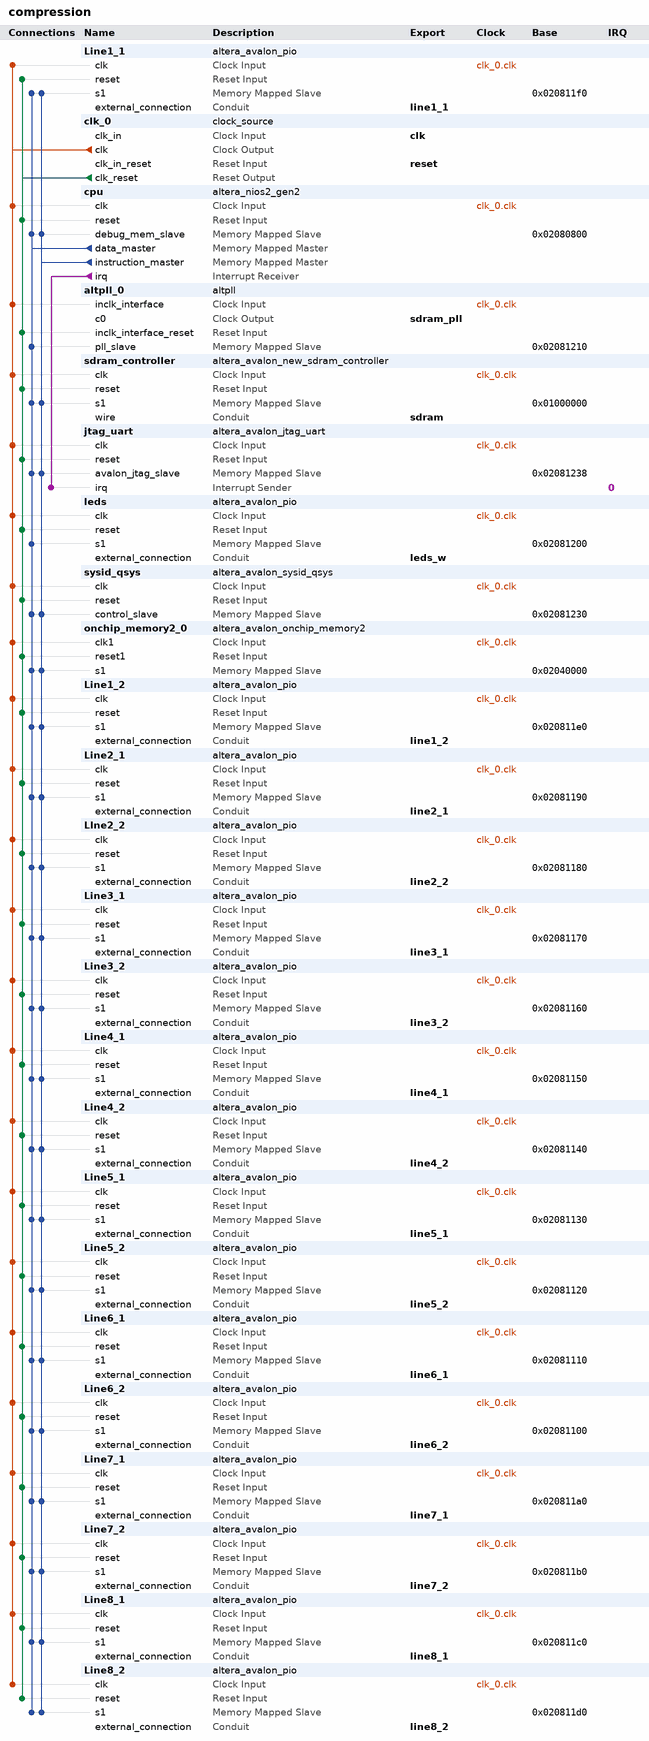
[diagram p0: system contents]
# Platform Designer (Qsys) system compression, Cyclone IV GX EP4CGX110CF23C7
# Parameters at their usual value, and those the tool derives, are not listed.
package require -exact qsys 18.1
create_system compression
set_project_property DEVICE_FAMILY {Cyclone IV GX}
set_project_property DEVICE EP4CGX110CF23C7

add_instance Line1_1 altera_avalon_pio 18.1
set_instance_parameter_value Line1_1 direction InOut
set_instance_parameter_value Line1_1 width 32

add_instance clk_0 clock_source 18.1
set_instance_parameter_value clk_0 clockFrequency 50000000

add_instance cpu altera_nios2_gen2 18.1
set_instance_parameter_value cpu dcache_size 2048
set_instance_parameter_value cpu exceptionSlave sdram_controller.s1
set_instance_parameter_value cpu icache_size 65536
set_instance_parameter_value cpu impl Tiny
set_instance_parameter_value cpu resetSlave sdram_controller.s1

add_instance altpll_0 altpll 18.1
set_instance_parameter_value altpll_0 CLK0_DIVIDE_BY 1
set_instance_parameter_value altpll_0 CLK0_MULTIPLY_BY 1
set_instance_parameter_value altpll_0 CLK0_PHASE_SHIFT -3000
set_instance_parameter_value altpll_0 INCLK0_INPUT_FREQUENCY 20000
set_instance_parameter_value altpll_0 PORT_ARESET PORT_UNUSED
set_instance_parameter_value altpll_0 PORT_LOCKED PORT_UNUSED
set_instance_parameter_value altpll_0 PORT_clk1 PORT_UNUSED
set_instance_parameter_value altpll_0 PORT_clk2 PORT_UNUSED
set_instance_parameter_value altpll_0 PORT_clk3 PORT_UNUSED

add_instance sdram_controller altera_avalon_new_sdram_controller 18.1
set_instance_parameter_value sdram_controller TAC 5.5
set_instance_parameter_value sdram_controller TRCD 20.0
set_instance_parameter_value sdram_controller TRP 20.0
set_instance_parameter_value sdram_controller casLatency 3
set_instance_parameter_value sdram_controller columnWidth 8
set_instance_parameter_value sdram_controller dataWidth 32
set_instance_parameter_value sdram_controller generateSimulationModel false
set_instance_parameter_value sdram_controller model single_Micron_MT48LC4M32B2_7_chip
set_instance_parameter_value sdram_controller numberOfBanks 4
set_instance_parameter_value sdram_controller numberOfChipSelects 1
set_instance_parameter_value sdram_controller powerUpDelay 100.0
set_instance_parameter_value sdram_controller refreshPeriod 15.625
set_instance_parameter_value sdram_controller rowWidth 12

add_instance jtag_uart altera_avalon_jtag_uart 18.1
set_instance_parameter_value jtag_uart simInteractiveOptions NO_INTERACTIVE_WINDOWS

add_instance leds altera_avalon_pio 18.1
set_instance_parameter_value leds direction Output
set_instance_parameter_value leds width 8

add_instance sysid_qsys altera_avalon_sysid_qsys 18.1
set_instance_parameter_value sysid_qsys id 0

add_instance onchip_memory2_0 altera_avalon_onchip_memory2 18.1
set_instance_parameter_value onchip_memory2_0 dataWidth 32
set_instance_parameter_value onchip_memory2_0 dualPort false
set_instance_parameter_value onchip_memory2_0 initMemContent true
set_instance_parameter_value onchip_memory2_0 initializationFileName onchip_mem.hex
set_instance_parameter_value onchip_memory2_0 memorySize 204800

add_instance Line1_2 altera_avalon_pio 18.1
set_instance_parameter_value Line1_2 direction InOut
set_instance_parameter_value Line1_2 width 32

add_instance Line2_1 altera_avalon_pio 18.1
set_instance_parameter_value Line2_1 direction InOut
set_instance_parameter_value Line2_1 width 32

add_instance LIne2_2 altera_avalon_pio 18.1
set_instance_parameter_value LIne2_2 direction InOut
set_instance_parameter_value LIne2_2 width 32

add_instance Line3_1 altera_avalon_pio 18.1
set_instance_parameter_value Line3_1 direction InOut
set_instance_parameter_value Line3_1 width 32

add_instance Line3_2 altera_avalon_pio 18.1
set_instance_parameter_value Line3_2 direction InOut
set_instance_parameter_value Line3_2 width 32

add_instance Line4_1 altera_avalon_pio 18.1
set_instance_parameter_value Line4_1 direction InOut
set_instance_parameter_value Line4_1 width 32

add_instance Line4_2 altera_avalon_pio 18.1
set_instance_parameter_value Line4_2 direction InOut
set_instance_parameter_value Line4_2 width 32

add_instance Line5_1 altera_avalon_pio 18.1
set_instance_parameter_value Line5_1 direction InOut
set_instance_parameter_value Line5_1 width 32

add_instance Line5_2 altera_avalon_pio 18.1
set_instance_parameter_value Line5_2 direction InOut
set_instance_parameter_value Line5_2 width 32

add_instance Line6_1 altera_avalon_pio 18.1
set_instance_parameter_value Line6_1 direction InOut
set_instance_parameter_value Line6_1 width 32

add_instance Line6_2 altera_avalon_pio 18.1
set_instance_parameter_value Line6_2 direction InOut
set_instance_parameter_value Line6_2 width 32

add_instance Line7_1 altera_avalon_pio 18.1
set_instance_parameter_value Line7_1 direction InOut
set_instance_parameter_value Line7_1 width 32

add_instance Line7_2 altera_avalon_pio 18.1
set_instance_parameter_value Line7_2 direction InOut
set_instance_parameter_value Line7_2 width 32

add_instance Line8_1 altera_avalon_pio 18.1
set_instance_parameter_value Line8_1 direction InOut
set_instance_parameter_value Line8_1 width 32

add_instance Line8_2 altera_avalon_pio 18.1
set_instance_parameter_value Line8_2 direction InOut
set_instance_parameter_value Line8_2 width 32

# connections
add_connection clk_0.clk altpll_0.inclk_interface clock
add_connection clk_0.clk cpu.clk clock
add_connection clk_0.clk jtag_uart.clk clock
add_connection clk_0.clk leds.clk clock
add_connection clk_0.clk Line1_1.clk clock
add_connection clk_0.clk Line1_2.clk clock
add_connection clk_0.clk Line2_1.clk clock
add_connection clk_0.clk LIne2_2.clk clock
add_connection clk_0.clk Line3_1.clk clock
add_connection clk_0.clk Line3_2.clk clock
add_connection clk_0.clk Line4_1.clk clock
add_connection clk_0.clk Line4_2.clk clock
add_connection clk_0.clk Line5_1.clk clock
add_connection clk_0.clk Line5_2.clk clock
add_connection clk_0.clk Line6_1.clk clock
add_connection clk_0.clk Line6_2.clk clock
add_connection clk_0.clk Line7_1.clk clock
add_connection clk_0.clk Line7_2.clk clock
add_connection clk_0.clk Line8_1.clk clock
add_connection clk_0.clk Line8_2.clk clock
add_connection clk_0.clk onchip_memory2_0.clk1 clock
add_connection clk_0.clk sdram_controller.clk clock
add_connection clk_0.clk sysid_qsys.clk clock
add_connection clk_0.clk_reset altpll_0.inclk_interface_reset reset
add_connection clk_0.clk_reset cpu.reset reset
add_connection clk_0.clk_reset jtag_uart.reset reset
add_connection clk_0.clk_reset leds.reset reset
add_connection clk_0.clk_reset Line1_1.reset reset
add_connection clk_0.clk_reset Line1_2.reset reset
add_connection clk_0.clk_reset Line2_1.reset reset
add_connection clk_0.clk_reset LIne2_2.reset reset
add_connection clk_0.clk_reset Line3_1.reset reset
add_connection clk_0.clk_reset Line3_2.reset reset
add_connection clk_0.clk_reset Line4_1.reset reset
add_connection clk_0.clk_reset Line4_2.reset reset
add_connection clk_0.clk_reset Line5_1.reset reset
add_connection clk_0.clk_reset Line5_2.reset reset
add_connection clk_0.clk_reset Line6_1.reset reset
add_connection clk_0.clk_reset Line6_2.reset reset
add_connection clk_0.clk_reset Line7_1.reset reset
add_connection clk_0.clk_reset Line7_2.reset reset
add_connection clk_0.clk_reset Line8_1.reset reset
add_connection clk_0.clk_reset Line8_2.reset reset
add_connection clk_0.clk_reset onchip_memory2_0.reset1 reset
add_connection clk_0.clk_reset sdram_controller.reset reset
add_connection clk_0.clk_reset sysid_qsys.reset reset
add_connection cpu.data_master altpll_0.pll_slave avalon
set_connection_parameter_value cpu.data_master/altpll_0.pll_slave baseAddress 0x02081210
add_connection cpu.data_master cpu.debug_mem_slave avalon
set_connection_parameter_value cpu.data_master/cpu.debug_mem_slave baseAddress 0x02080800
add_connection cpu.data_master jtag_uart.avalon_jtag_slave avalon
set_connection_parameter_value cpu.data_master/jtag_uart.avalon_jtag_slave baseAddress 0x02081238
add_connection cpu.data_master leds.s1 avalon
set_connection_parameter_value cpu.data_master/leds.s1 baseAddress 0x02081200
add_connection cpu.data_master Line1_1.s1 avalon
set_connection_parameter_value cpu.data_master/Line1_1.s1 baseAddress 0x020811f0
add_connection cpu.data_master Line1_2.s1 avalon
set_connection_parameter_value cpu.data_master/Line1_2.s1 baseAddress 0x020811e0
add_connection cpu.data_master Line2_1.s1 avalon
set_connection_parameter_value cpu.data_master/Line2_1.s1 baseAddress 0x02081190
add_connection cpu.data_master LIne2_2.s1 avalon
set_connection_parameter_value cpu.data_master/LIne2_2.s1 baseAddress 0x02081180
add_connection cpu.data_master Line3_1.s1 avalon
set_connection_parameter_value cpu.data_master/Line3_1.s1 baseAddress 0x02081170
add_connection cpu.data_master Line3_2.s1 avalon
set_connection_parameter_value cpu.data_master/Line3_2.s1 baseAddress 0x02081160
add_connection cpu.data_master Line4_1.s1 avalon
set_connection_parameter_value cpu.data_master/Line4_1.s1 baseAddress 0x02081150
add_connection cpu.data_master Line4_2.s1 avalon
set_connection_parameter_value cpu.data_master/Line4_2.s1 baseAddress 0x02081140
add_connection cpu.data_master Line5_1.s1 avalon
set_connection_parameter_value cpu.data_master/Line5_1.s1 baseAddress 0x02081130
add_connection cpu.data_master Line5_2.s1 avalon
set_connection_parameter_value cpu.data_master/Line5_2.s1 baseAddress 0x02081120
add_connection cpu.data_master Line6_1.s1 avalon
set_connection_parameter_value cpu.data_master/Line6_1.s1 baseAddress 0x02081110
add_connection cpu.data_master Line6_2.s1 avalon
set_connection_parameter_value cpu.data_master/Line6_2.s1 baseAddress 0x02081100
add_connection cpu.data_master Line7_1.s1 avalon
set_connection_parameter_value cpu.data_master/Line7_1.s1 baseAddress 0x020811a0
add_connection cpu.data_master Line7_2.s1 avalon
set_connection_parameter_value cpu.data_master/Line7_2.s1 baseAddress 0x020811b0
add_connection cpu.data_master Line8_1.s1 avalon
set_connection_parameter_value cpu.data_master/Line8_1.s1 baseAddress 0x020811c0
add_connection cpu.data_master Line8_2.s1 avalon
set_connection_parameter_value cpu.data_master/Line8_2.s1 baseAddress 0x020811d0
add_connection cpu.data_master onchip_memory2_0.s1 avalon
set_connection_parameter_value cpu.data_master/onchip_memory2_0.s1 baseAddress 0x02040000
add_connection cpu.data_master sdram_controller.s1 avalon
set_connection_parameter_value cpu.data_master/sdram_controller.s1 baseAddress 0x01000000
add_connection cpu.data_master sysid_qsys.control_slave avalon
set_connection_parameter_value cpu.data_master/sysid_qsys.control_slave baseAddress 0x02081230
add_connection cpu.instruction_master cpu.debug_mem_slave avalon
set_connection_parameter_value cpu.instruction_master/cpu.debug_mem_slave baseAddress 0x02080800
add_connection cpu.instruction_master jtag_uart.avalon_jtag_slave avalon
set_connection_parameter_value cpu.instruction_master/jtag_uart.avalon_jtag_slave baseAddress 0x02081238
add_connection cpu.instruction_master Line1_1.s1 avalon
set_connection_parameter_value cpu.instruction_master/Line1_1.s1 baseAddress 0x020811f0
add_connection cpu.instruction_master Line1_2.s1 avalon
set_connection_parameter_value cpu.instruction_master/Line1_2.s1 baseAddress 0x020811e0
add_connection cpu.instruction_master Line2_1.s1 avalon
set_connection_parameter_value cpu.instruction_master/Line2_1.s1 baseAddress 0x02081190
add_connection cpu.instruction_master LIne2_2.s1 avalon
set_connection_parameter_value cpu.instruction_master/LIne2_2.s1 baseAddress 0x02081180
add_connection cpu.instruction_master Line3_1.s1 avalon
set_connection_parameter_value cpu.instruction_master/Line3_1.s1 baseAddress 0x02081170
add_connection cpu.instruction_master Line3_2.s1 avalon
set_connection_parameter_value cpu.instruction_master/Line3_2.s1 baseAddress 0x02081160
add_connection cpu.instruction_master Line4_1.s1 avalon
set_connection_parameter_value cpu.instruction_master/Line4_1.s1 baseAddress 0x02081150
add_connection cpu.instruction_master Line4_2.s1 avalon
set_connection_parameter_value cpu.instruction_master/Line4_2.s1 baseAddress 0x02081140
add_connection cpu.instruction_master Line5_1.s1 avalon
set_connection_parameter_value cpu.instruction_master/Line5_1.s1 baseAddress 0x02081130
add_connection cpu.instruction_master Line5_2.s1 avalon
set_connection_parameter_value cpu.instruction_master/Line5_2.s1 baseAddress 0x02081120
add_connection cpu.instruction_master Line6_1.s1 avalon
set_connection_parameter_value cpu.instruction_master/Line6_1.s1 baseAddress 0x02081110
add_connection cpu.instruction_master Line6_2.s1 avalon
set_connection_parameter_value cpu.instruction_master/Line6_2.s1 baseAddress 0x02081100
add_connection cpu.instruction_master Line7_1.s1 avalon
set_connection_parameter_value cpu.instruction_master/Line7_1.s1 baseAddress 0x020811a0
add_connection cpu.instruction_master Line7_2.s1 avalon
set_connection_parameter_value cpu.instruction_master/Line7_2.s1 baseAddress 0x020811b0
add_connection cpu.instruction_master Line8_1.s1 avalon
set_connection_parameter_value cpu.instruction_master/Line8_1.s1 baseAddress 0x020811c0
add_connection cpu.instruction_master Line8_2.s1 avalon
set_connection_parameter_value cpu.instruction_master/Line8_2.s1 baseAddress 0x020811d0
add_connection cpu.instruction_master onchip_memory2_0.s1 avalon
set_connection_parameter_value cpu.instruction_master/onchip_memory2_0.s1 baseAddress 0x02040000
add_connection cpu.instruction_master sdram_controller.s1 avalon
set_connection_parameter_value cpu.instruction_master/sdram_controller.s1 baseAddress 0x01000000
add_connection cpu.instruction_master sysid_qsys.control_slave avalon
set_connection_parameter_value cpu.instruction_master/sysid_qsys.control_slave baseAddress 0x02081230
add_connection cpu.irq jtag_uart.irq interrupt
set_connection_parameter_value cpu.irq/jtag_uart.irq irqNumber 0

# exported interfaces
add_interface clk clock sink
set_interface_property clk EXPORT_OF clk_0.clk_in
add_interface leds_w conduit end
set_interface_property leds_w EXPORT_OF leds.external_connection
add_interface line1_1 conduit end
set_interface_property line1_1 EXPORT_OF Line1_1.external_connection
add_interface line1_2 conduit end
set_interface_property line1_2 EXPORT_OF Line1_2.external_connection
add_interface line2_1 conduit end
set_interface_property line2_1 EXPORT_OF Line2_1.external_connection
add_interface line2_2 conduit end
set_interface_property line2_2 EXPORT_OF LIne2_2.external_connection
add_interface line3_1 conduit end
set_interface_property line3_1 EXPORT_OF Line3_1.external_connection
add_interface line3_2 conduit end
set_interface_property line3_2 EXPORT_OF Line3_2.external_connection
add_interface line4_1 conduit end
set_interface_property line4_1 EXPORT_OF Line4_1.external_connection
add_interface line4_2 conduit end
set_interface_property line4_2 EXPORT_OF Line4_2.external_connection
add_interface line5_1 conduit end
set_interface_property line5_1 EXPORT_OF Line5_1.external_connection
add_interface line5_2 conduit end
set_interface_property line5_2 EXPORT_OF Line5_2.external_connection
add_interface line6_1 conduit end
set_interface_property line6_1 EXPORT_OF Line6_1.external_connection
add_interface line6_2 conduit end
set_interface_property line6_2 EXPORT_OF Line6_2.external_connection
add_interface line7_1 conduit end
set_interface_property line7_1 EXPORT_OF Line7_1.external_connection
add_interface line7_2 conduit end
set_interface_property line7_2 EXPORT_OF Line7_2.external_connection
add_interface line8_1 conduit end
set_interface_property line8_1 EXPORT_OF Line8_1.external_connection
add_interface line8_2 conduit end
set_interface_property line8_2 EXPORT_OF Line8_2.external_connection
add_interface reset reset sink
set_interface_property reset EXPORT_OF clk_0.clk_in_reset
add_interface sdram conduit end
set_interface_property sdram EXPORT_OF sdram_controller.wire
add_interface sdram_pll clock source
set_interface_property sdram_pll EXPORT_OF altpll_0.c0

set_interconnect_requirement {$system} qsys_mm.clockCrossingAdapter HANDSHAKE
set_interconnect_requirement {$system} qsys_mm.enableEccProtection FALSE
set_interconnect_requirement {$system} qsys_mm.insertDefaultSlave FALSE
set_interconnect_requirement {$system} qsys_mm.maxAdditionalLatency 1

save_system compression.qsys
